# Altium schematic sheet 02)CPU-2.SchDoc
size 297 x 209 mm
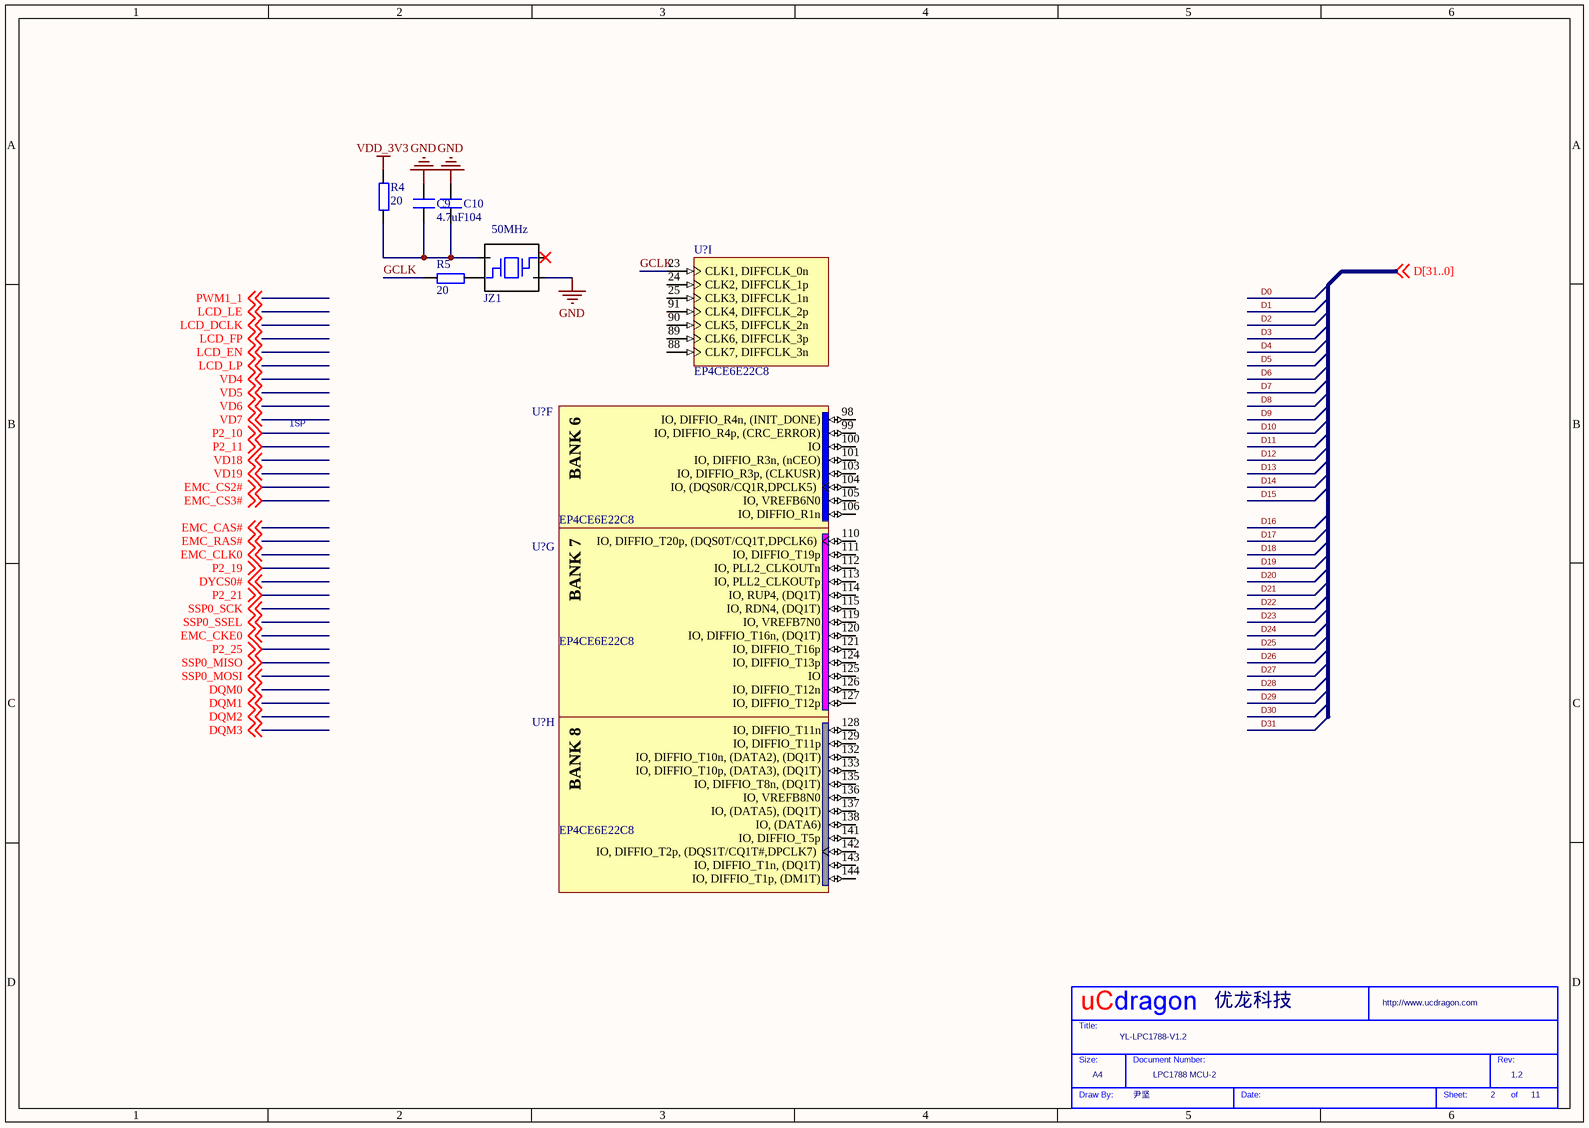
[diagram p0: 02)CPU-2.SchDoc]

## Parts
(Parts that share a designator on the sheet are numbered #1, #2 ... from top to bottom, then left to right.)
*  Page Count: 11  Page Number: 2  Page Size: A4  Title: YL-LPC1788-V1.2  RevCode: 1.2  Doc: LPC1788 MCU-2  Drawing: 尹坚  Company: 优龙科技  (hidden comment: My Title 0)  (graphical)
C9  4.7uF  [0805]
C10  104  [0603]
JZ1  50MHz  [Q5*7]
R4  20  [0603]
R5  20  [0603]
U?#1  EP4CE6E22C8  [EQFP144_N]  (part I of 13)
U?#2  EP4CE6E22C8  [EQFP144_N]  (part F of 13)
U?#3  EP4CE6E22C8  [EQFP144_N]  (part G of 13)
U?#4  EP4CE6E22C8  [EQFP144_N]  (part H of 13)

## Nets
GND: C9.1 C10.1 JZ1.2
VDD_3V3: R4.2
GCLK: R5.1 U?#1.23(CLK1,_DIFFCLK_0n)
NetC9_2: C9.2 C10.2 JZ1.4 R4.1
NetJZ1_3: JZ1.3 R5.2

Not connected (* = marked no-connect by the designer): JZ1 1*; U?#1 24(CLK2,_DIFFCLK_1p) 25(CLK3,_DIFFCLK_1n) 88(CLK7,_DIFFCLK_3n) 89(CLK6,_DIFFCLK_3p) 90(CLK5,_DIFFCLK_2n) 91(CLK4,_DIFFCLK_2p); U?#2 98(IO,_DIFFIO_R4n,_(INIT_DONE)) 99(IO,_DIFFIO_R4p,_(CRC_ERROR)) 100(IO) 101(IO,_DIFFIO_R3n,_(nCEO)) 103(IO,_DIFFIO_R3p,_(CLKUSR)) 104(IO,_(DQS0R/CQ1R,DPCLK5)) 105(IO,_VREFB6N0) 106(IO,_DIFFIO_R1n); U?#3 110(IO,_DIFFIO_T20p,_(DQS0T/CQ1T,DPCLK6)) 111(IO,_DIFFIO_T19p) 112(IO,_PLL2_CLKOUTn) 113(IO,_PLL2_CLKOUTp) 114(IO,_RUP4,_(DQ1T)) 115(IO,_RDN4,_(DQ1T)) 119(IO,_VREFB7N0) 120(IO,_DIFFIO_T16n,_(DQ1T)) 121(IO,_DIFFIO_T16p) 124(IO,_DIFFIO_T13p) 125(IO) 126(IO,_DIFFIO_T12n) 127(IO,_DIFFIO_T12p); U?#4 128(IO,_DIFFIO_T11n) 129(IO,_DIFFIO_T11p) 132(IO,_DIFFIO_T10n,_(DATA2),_(DQ1T)) 133(IO,_DIFFIO_T10p,_(DATA3),_(DQ1T)) 135(IO,_DIFFIO_T8n,_(DQ1T)) 136(IO,_VREFB8N0) 137(IO,_(DATA5),_(DQ1T)) 138(IO,_(DATA6)) 141(IO,_DIFFIO_T5p) 142(IO,_DIFFIO_T2p,_(DQS1T/CQ1T#,DPCLK7)) 143(IO,_DIFFIO_T1n,_(DQ1T)) 144(IO,_DIFFIO_T1p,_(DM1T))

## Notes on the sheet
- ISP
- (in symbol EP4CE6E22C8, part F) BANK 6
- (in symbol EP4CE6E22C8, part G) BANK 7
- (in symbol EP4CE6E22C8, part H) BANK 8
- (in symbol My Title 0) Title:; Size:; Document Number:; Rev:; Draw By:; Date:; Sheet:; of

## Library data of the parts
C9 C10 = C
JZ1 = JZ-4P: 4脚晶振; pin to pad: 0>1
R4 R5 = R
U?#1-U?#4 = EP4CE6E22C8: Cyclone IV Family FPGA, 2V Core, 91 I/O Pins, 2 PLLs, 144-Pin QFP, Speed Grade 8, Commercial Grade; Published: 3-May-2010; DatasheetVersion: ver1.2, Mar-2010; PackageVersion: ver16.0, Dec-2009; PackageReference: EQFP144; Publisher: Altium Limited; PackageDescription: 144-Pin Plastic Enhanced Quad Flat Pack (EQFP144) - Wire Bond; Code_JEDEC: MS-026-BFB; ComponentLink1Description: Manufacturer Link; ComponentLink1URL: http://www.altera.com/; ComponentLink2Description: Handbook; ComponentLink2URL: http://www.altera.com/literature/hb/cyclone-iv/cyclone4-handbook.pdf; ComponentLink3Description: Pinout Specification; ComponentLink3URL: http://www.altera.com/literature/lit-dp.jsp?category=cyc%204&showspreadsheet=y; ComponentLink4Description: Packaging Specification; ComponentLink4URL: http://www.altera.com/literature/ds/dspkg.pdf
* = My Title 0: Page Create Date: May 29, 2006; WebSite: http://www.ucdragon.com